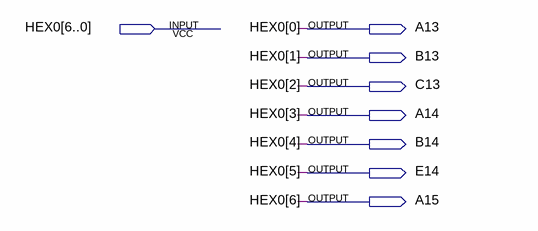
[diagram p0: schematic sheet]
// Quartus schematic Display1.bdf as structural Verilog: 0 symbols, 8 pins
module Display1 (
  input  [6:0] HEX0,
  output A13,
  output B13,
  output C13,
  output A14,
  output B14,
  output E14,
  output A15
);


  assign A13 = HEX0[0];
  assign A14 = HEX0[3];
  assign A15 = HEX0[6];
  assign B13 = HEX0[1];
  assign B14 = HEX0[4];
  assign C13 = HEX0[2];
  assign E14 = HEX0[5];
endmodule
